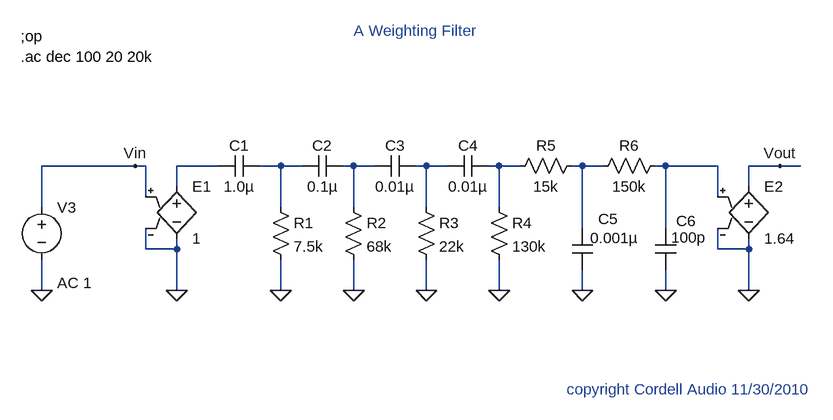
[diagram p0: schematic A_Weighting_Filter.asc]
A_Weighting_Filter.asc, the LTspice schematic file:
Version 4
SHEET 1 1692 1236
WIRE 64 480 -80 480
WIRE 80 480 64 480
WIRE 192 480 128 480
WIRE 288 480 256 480
WIRE 320 480 288 480
WIRE 400 480 384 480
WIRE 432 480 400 480
WIRE 512 480 496 480
WIRE 544 480 512 480
WIRE 624 480 608 480
WIRE 656 480 624 480
WIRE 752 480 736 480
WIRE 784 480 752 480
WIRE 880 480 864 480
WIRE 960 480 880 480
WIRE 1056 480 1008 480
WIRE 1088 480 1056 480
WIRE 128 512 128 480
WIRE 1008 512 1008 480
WIRE 80 528 80 480
WIRE 960 528 960 480
WIRE -80 544 -80 480
WIRE 288 544 288 480
WIRE 400 544 400 480
WIRE 512 544 512 480
WIRE 624 544 624 480
WIRE 752 576 752 480
WIRE 880 576 880 480
WIRE 80 608 80 576
WIRE 128 608 128 592
WIRE 128 608 80 608
WIRE 960 608 960 576
WIRE 1008 608 1008 592
WIRE 1008 608 960 608
WIRE -80 672 -80 624
WIRE 128 672 128 608
WIRE 288 672 288 624
WIRE 400 672 400 624
WIRE 512 672 512 624
WIRE 624 672 624 624
WIRE 752 672 752 640
WIRE 880 672 880 640
WIRE 1008 672 1008 608
FLAG -80 672 0
FLAG 288 672 0
FLAG 400 672 0
FLAG 512 672 0
FLAG 624 672 0
FLAG 752 672 0
FLAG 880 672 0
FLAG 1008 672 0
FLAG 1056 480 Vout
FLAG 128 672 0
FLAG 64 480 Vin
SYMBOL voltage -80 528 R0
WINDOW 3 -181 172 Left 0
WINDOW 123 24 132 Left 0
WINDOW 39 0 0 Left 0
SYMATTR Value ""
SYMATTR Value2 AC 1
SYMATTR InstName V3
SYMBOL cap 256 464 R90
WINDOW 3 32 32 VTop 0
WINDOW 0 0 32 VBottom 0
SYMATTR Value 1.0µ
SYMATTR InstName C1
SYMBOL res 272 528 R0
SYMATTR InstName R1
SYMATTR Value 7.5k
SYMBOL cap 384 464 R90
WINDOW 3 32 32 VTop 0
WINDOW 0 0 32 VBottom 0
SYMATTR Value 0.1µ
SYMATTR InstName C2
SYMBOL res 384 528 R0
SYMATTR InstName R2
SYMATTR Value 68k
SYMBOL cap 496 464 R90
WINDOW 3 32 32 VTop 0
WINDOW 0 0 32 VBottom 0
SYMATTR Value 0.01µ
SYMATTR InstName C3
SYMBOL res 496 528 R0
SYMATTR InstName R3
SYMATTR Value 22k
SYMBOL cap 608 464 R90
WINDOW 3 32 32 VTop 0
WINDOW 0 0 32 VBottom 0
SYMATTR Value 0.01µ
SYMATTR InstName C4
SYMBOL res 608 528 R0
SYMATTR InstName R4
SYMATTR Value 130k
SYMBOL res 752 464 R90
WINDOW 0 0 56 VBottom 0
WINDOW 3 32 56 VTop 0
SYMATTR InstName R5
SYMATTR Value 15k
SYMBOL cap 768 640 R180
WINDOW 3 -70 49 Left 0
WINDOW 0 -39 78 Left 0
SYMATTR Value 0.001µ
SYMATTR InstName C5
SYMBOL res 880 464 R90
WINDOW 0 0 56 VBottom 0
WINDOW 3 32 56 VTop 0
SYMATTR InstName R6
SYMATTR Value 150k
SYMBOL cap 896 640 R180
WINDOW 3 -47 50 Left 0
WINDOW 0 -31 75 Left 0
SYMATTR Value 100p
SYMATTR InstName C6
SYMBOL e 1008 496 R0
SYMATTR InstName E2
SYMATTR Value 1.64
SYMBOL e 128 496 R0
SYMATTR InstName E1
SYMATTR Value 1
TEXT -112 280 Left 0 !;op
TEXT -112 312 Left 0 !.ac dec 100 20 20k
TEXT 400 272 Left 0 ;A Weighting Filter
TEXT 728 824 Left 0 ;copyright Cordell Audio 11/30/2010

The netlist it stands for:
* A_Weighting_Filter.asc
V3 Vin 0 AC 1
C1 N002 N001 1.0µ
R1 N002 0 7.5k
C2 N003 N002 0.1µ
R2 N003 0 68k
C3 N004 N003 0.01µ
R3 N004 0 22k
C4 N005 N004 0.01µ
R4 N005 0 130k
R5 N006 N005 15k
C5 0 N006 0.001µ
R6 N007 N006 150k
C6 0 N007 100p
E2 Vout 0 N007 0 1.64
E1 N001 0 Vin 0 1
;op
.ac dec 100 20 20k
* A Weighting Filter
* copyright Cordell Audio 11/30/2010
.backanno
.end